# Altium schematic sheet Regulation_Charging.SchDoc
size A3; Organization: Altium Limited; Address1: L3, 12a Rodborough Rd; Address2: Frenchs Forest; Address3: NSW; Address4: Australia 2086; SheetNumber: 7; SheetTotal: 8
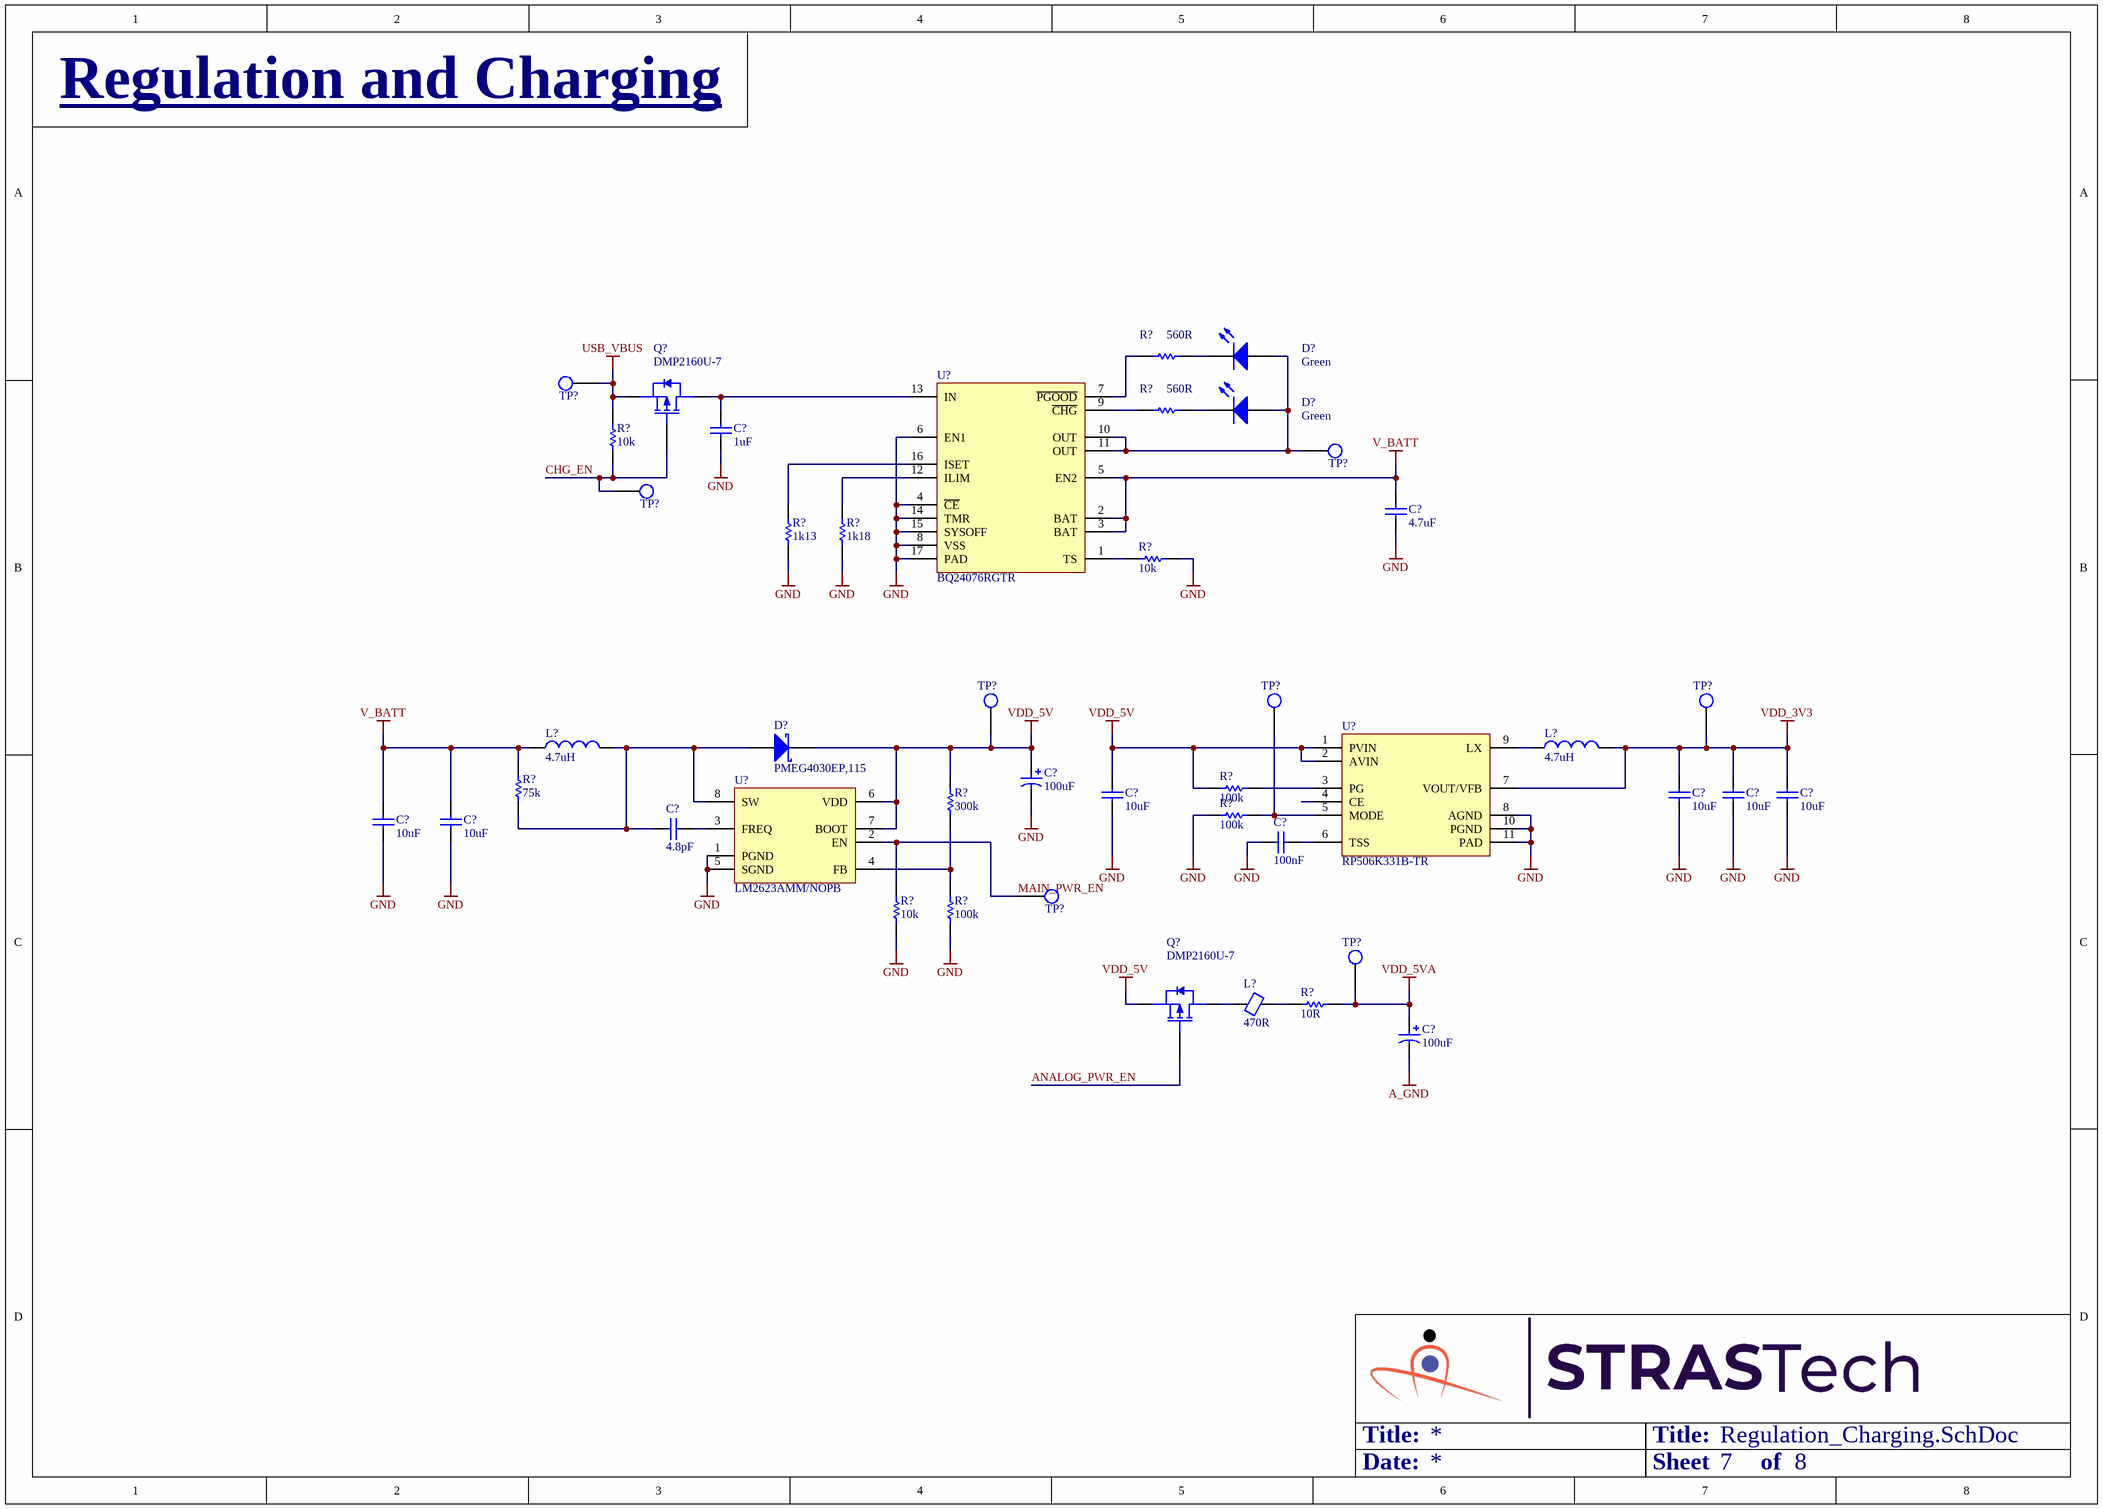
[diagram p0: Regulation_Charging.SchDoc]

## Parts
(Parts that share a designator on the sheet are numbered #1, #2 ... from top to bottom, then left to right.)
C?#1  1uF  [Cap,SMD,0402]
C?#2  4.7uF  [Cap,SMD,0402]
C?#3  100uF  [Cap,Alum,SMD,D5,H5.8]
C?#4  10uF  [Cap,SMD,0402]
C?#5  10uF  [Cap,SMD,0402]
C?#6  10uF  [Cap,SMD,0402]
C?#7  10uF  [Cap,SMD,0402]
C?#8  10uF  [Cap,SMD,0402]
C?#9  10uF  [Cap,SMD,0402]
C?#10  4.8pF  [Cap,SMD,0402]
C?#11  100nF  [Cap,SMD,0402]
C?#12  100uF  [Cap,Alum,SMD,D5,H5.8]
D?#1  Green  [LED,0603]
D?#2  Green  [LED,0603]
D?#3  PMEG4030EP,115  [SOD128]
L?#1  4.7uH  [IND,WIREWOUND,4.9x4.9,SMD]
L?#2  4.7uH  [IND,WIREWOUND,4.9x4.9,SMD]
L?#3  470R  [IND,0402]
Q?#1  DMP2160U-7  [SOT23-3]
Q?#2  DMP2160U-7  [SOT23-3]
R?#1  560R  [RES,0402]
R?#2  560R  [RES,0402]
R?#3  10k  [RES,0402]
R?#4  1k13  [RES,0402]
R?#5  1k18  [RES,0402]
R?#6  10k  [RES,0402]
R?#7  75k  [RES,0402]
R?#8  100k  [RES,0402]
R?#9  300k  [RES,0402]
R?#10  100k  [RES,0402]
R?#11  10k  [RES,0402]
R?#12  100k  [RES,0402]
R?#13  10R  [RES,0402]
TP?#1  TESTPOINT  [testpoint,smd,round,1mm]  (value not drawn)
TP?#2  TESTPOINT  [testpoint,smd,round,1mm]  (value not drawn)
TP?#3  TESTPOINT  [testpoint,smd,round,1mm]  (value not drawn)
TP?#4  TESTPOINT  [testpoint,smd,round,1mm]  (value not drawn)
TP?#5  TESTPOINT  [testpoint,smd,round,1mm]  (value not drawn)
TP?#6  TESTPOINT  [testpoint,smd,round,1mm]  (value not drawn)
TP?#7  TESTPOINT  [testpoint,smd,round,1mm]  (value not drawn)
TP?#8  TESTPOINT  [testpoint,smd,round,1mm]  (value not drawn)
U?#1  BQ24076RGTR  [IC,QFN-16,3x3]
U?#2  RP506K331B-TR  [IC,DFN-10_3x3,P0.5mm]
U?#3  LM2623AMM/NOPB  [IC,TSSOP-8,W3.0]

## Nets
A_GND: C?#12.2
GND: C?#1.1 C?#2.1 C?#3.2 C?#4.1 C?#5.1 C?#6.1 C?#7.1 C?#8.1 C?#9.1 C?#11.1 R?#4.1 R?#5.1 R?#6.1 R?#10.2 R?#11.1 R?#12.1 U?#1.4(~{CE}) U?#1.6(EN1) U?#1.8(VSS) U?#1.14(TMR) U?#1.15(SYSOFF) U?#1.17(PAD) U?#2.8(AGND) U?#2.10(PGND) U?#2.11(PAD) U?#3.1(PGND) U?#3.5(SGND)
USB_VBUS: Q?#1.2(S) R?#3.2 TP?#1.1(TP)
V_BATT: C?#2.2 C?#8.2 C?#9.2 L?#1.1 R?#7.2 U?#1.2(BAT) U?#1.3(BAT) U?#1.5(EN2)
VDD_3V3: C?#5.2 C?#6.2 C?#7.2 L?#2.2 TP?#6.1(TP) U?#2.7(VOUT/VFB)
VDD_5V: C?#3.1 C?#4.2 D?#3.1(K) Q?#2.2(S) R?#8.2 R?#9.2 TP?#4.1(TP) U?#2.1(PVIN) U?#2.2(AVIN) U?#3.6(VDD) U?#3.7(BOOT)
VDD_5VA: C?#12.1 R?#13.2 TP?#8.1(TP)
ANALOG_PWR_EN: Q?#2.1(G)
CHG_EN: Q?#1.1(G) R?#3.1 TP?#3.1(TP)
MAIN_PWR_EN: R?#11.2 TP?#7.1(TP) U?#3.2(EN)
NetC?#1_2: C?#1.2 Q?#1.3(D) U?#1.13(IN)
NetC?#10_1: C?#10.1 D?#3.2(A) L?#1.2 R?#7.1 U?#3.8(SW)
NetC?#10_2: C?#10.2 U?#3.3(FREQ)
NetC?#11_2: C?#11.2 U?#2.6(TSS)
NetD?#1_1: D?#1.1(A) D?#2.1(A) TP?#2.1(TP) U?#1.10(OUT) U?#1.11(OUT)
NetD?#1_2: D?#1.2(K) R?#1.2
NetD?#2_2: D?#2.2(K) R?#2.2
NetL?#2_1: L?#2.1 U?#2.9(LX)
NetL?#3_1: L?#3.1 Q?#2.3(D)
NetL?#3_2: L?#3.2 R?#13.1
NetR?#1_1: R?#1.1 U?#1.7(~{PGOOD})
NetR?#2_1: R?#2.1 U?#1.9(~{CHG})
NetR?#4_2: R?#4.2 U?#1.16(ISET)
NetR?#5_2: R?#5.2 U?#1.12(ILIM)
NetR?#6_2: R?#6.2 U?#1.1(TS)
NetR?#8_1: R?#8.1 U?#2.3(PG)
NetR?#9_1: R?#9.1 R?#12.2 U?#3.4(FB)
NetR?#10_1: R?#10.1 TP?#5.1(TP) U?#2.5(MODE)

Not connected (* = marked no-connect by the designer): U?#2 4(CE)

## Notes on the sheet
- Regulation and Charging
- Title:
- Date:
- Sheet
- of
- Title
- Size:
- A3
- Revision:
- Design By:

## Library data of the parts
C?#1 = CAP,Cer,1uF,35VDC,X5R,0402: 1 µF ±10% 35V Ceramic Capacitor X5R 0402 (1005 Metric); Vendor Part Number: 445-9073-1-ND; Manufacturer: TDK Corporation; Manufacturer Part Number: C1005X5R1V105K050BC; Vendor: Digikey; HelpURL: https://product.tdk.com/info/en/catalog/datasheets/mlcc_commercial_general_en.pdf?ref_disty=digikey; CreatedBy: Judd Foster
C?#2 = CAP,Cer,4.7uF,16VDC,X5R,0402: 4.7 µF ±20% 16V Ceramic Capacitor X5R 0402 (1005 Metric); Vendor Part Number: 478-10788-1-ND; Manufacturer: AVX Corporation; Manufacturer Part Number: 0402YD475MAT2A; Vendor: Digikey; HelpURL: https://datasheets.avx.com/cx5r.pdf; CreatedBy: Judd Foster
C?#3 C?#12 = CAP,Alum,100uF,10VDC,SMD: CAP ALUM 100UF 20% 10V SMD; Vendor Part Number: PCE3867CT-ND; Manufacturer: Panasonic; Manufacturer Part Number: EEE-1AA101WR; Vendor: Digikey; HelpURL: https://media.digikey.com/pdf/Data%20Sheets/Panasonic%20Electronic%20Components/S_Series,Type_V_Rev2018.pdf; CreatedBy: Judd Foster
C?#4-C?#9 = CAP,Cer,10uF,10VDC,X5R,0402: 10 µF ±20% 10V Ceramic Capacitor X5R 0402 (1005 Metric); Vendor Part Number: 1276-1450-1-ND; Manufacturer: Samsung Electro-Mechanics; Manufacturer Part Number: CL05A106MP5NUNC; Vendor: Digikey; HelpURL: https://media.digikey.com/pdf/Data%20Sheets/Samsung%20PDFs/CL05A106MP5NUNC_Spec.pdf; CreatedBy: Judd Foster
C?#10 = CAP,Cer,4.8pF,50VDC,C0G/NP0,0402: 4.8 pF ±0.25pF 50V Ceramic Capacitor C0G, NP0 0402 (1005 Metric); Vendor Part Number: 490-17481-1-ND; Manufacturer: Murata Electronics; Manufacturer Part Number: GCQ1555C1H4R8CB01D; Vendor: Digikey; HelpURL: https://search.murata.co.jp/Ceramy/image/img/A01X/G101/ENG/GCQ1555C1H4R8CB01-01.pdf; CreatedBy: Judd Foster
C?#11 = CAP,Cer,100nF,25VDC,X7R,0402: 0.1µF ±10% 25V Ceramic Capacitor X7R 0402 (1005 Metric); Vendor Part Number: 490-14603-1-ND; Manufacturer: Murata Electronics; Manufacturer Part Number: GRM155R71E104KE14J; Vendor: Digikey; HelpURL: https://search.murata.co.jp/Ceramy/image/img/A01X/G101/ENG/GRM155R71E104KE14-01.pdf; CreatedBy: Judd Foster
D?#1 D?#2 = LED,Green,SMD,0603: Green 530nm LED Indication - Discrete 3V 0603 (1608 Metric); Manufacturer: Stanley Electric Co; Manufacturer Part Number: THG1111C-0005-TR; Vendor Part Number: 404-1286-1-ND; Vendor: Digikey; CreatedBy: Judd Foster; HelpURL: http://www.stanley-components.com/php/downloaddatafile.php?rp=0,THG1111C-0005_e.pdf
D?#3 = DIODE,Schottky,40V,3A,SMD: Diode Schottky 40V 3A Surface Mount CFP5; Manufacturer: Nexperia USA Inc.; Vendor Part Number: 1727-5841-1-ND; Vendor: Digikey; CreatedBy: Judd Foster; HelpURL: https://assets.nexperia.com/documents/data-sheet/PMEG4030EP.pdf; Manufacturer Part Number: PMEG4030EP,115
L?#1 L?#2 = IND,4.7uH,2.6A,Wirewound,SMD: 4.7µH Shielded Wirewound Inductor 2.6A 45.5mOhm Max Nonstandard; Vendor Part Number: 587-3605-1-ND; Manufacturer: Taiyo Yuden; Manufacturer Part Number: NRS5030T4R7MMGJV; Vendor: Digikey; HelpURL: https://ds.yuden.co.jp/TYCOMPAS/ut/detail?pn=NRS5030T4R7MMGJV%20%20&u=M; CreatedBy: Judd Foster
L?#3 = Ferrite,470R@100MHz,0402: 470 Ohms @ 100 MHz 1 Power Line Ferrite Bead 0402 (1005 Metric) 1A 200mOhm; Vendor Part Number: 490-10662-1-ND; Manufacturer: Murata Electronics; Manufacturer Part Number: BLM15PX471SN1D; Vendor: Digikey; HelpURL: https://www.murata.com/en-us/products/productdata/8796740059166/ENFA0018.pdf; CreatedBy: Judd Foster
Q?#1 Q?#2 = MOSFET,P Ch,20V,3.2A: P-Channel 20 V 3.2A (Ta) 1.4W (Ta) Surface Mount SOT-23-3; Manufacturer: Diodes Incorporated; Vendor Part Number: DMP2160UDICT-ND; Vendor: Digikey; CreatedBy: Judd Foster; HelpURL: https://media.digikey.com/pdf/Data%20Sheets/Diodes%20PDFs/DMP2160U.pdf; Manufacturer Part Number: DMP2160U-7
R?#1 R?#2 = RES,560R,1%,0.063W,0402: 560 Ohms ±1% 0.063W, 1/16W Chip Resistor 0402 (1005 Metric) Automotive AEC-Q200, Moisture Resistant Thick Film; Manufacturer: TE Connectivity Passive Product; Manufacturer Part Number: CRGCQ0402F560R; Vendor Part Number: A129624CT-ND; Vendor: Digikey; CreatedBy: Judd Foster; HelpURL: https://www.te.com/commerce/DocumentDelivery/DDEController?Action=srchrtrv&DocNm=1773204-3&DocType=DS&DocLang=English
R?#3 R?#6 R?#11 = RES,10k,5%,0.063W,0402: 10 kOhms ±5% 0.063W, 1/16W Chip Resistor 0402 (1005 Metric) Automotive AEC-Q200 Thick Film; Vendor Part Number: RMCF0402JT10K0CT-ND; Manufacturer: Stackpole Electronics Inc; Manufacturer Part Number: RMCF0402JT10K0; Vendor: DIgikey; HelpURL: https://www.seielect.com/catalog/sei-rmcf_rmcp.pdf; CreatedBy: Judd Foster
R?#4 = RES,1k13,1%,0.063W,0402: 1.13 kOhms ±1% 0.063W, 1/16W Chip Resistor 0402 (1005 Metric) Automotive AEC-Q200 Thick Film; Manufacturer: Stackpole Electronics Inc; Manufacturer Part Number: RMCF0402FT1K13; Vendor Part Number: RMCF0402FT1K13CT-ND; Vendor: Digikey; CreatedBy: Judd Foster; HelpURL: https://www.seielect.com/catalog/sei-rmcf_rmcp.pdf
R?#5 = RES,1k18,1%,0.063W,0402: 1.18 kOhms ±1% 0.063W, 1/16W Chip Resistor 0402 (1005 Metric) Automotive AEC-Q200 Thick Film; Manufacturer: Stackpole Electronics Inc; Manufacturer Part Number: RMCF0402FT1K18; Vendor Part Number: RMCF0402FT1K18CT-ND; Vendor: Digikey; CreatedBy: Judd Foster; HelpURL: https://www.seielect.com/catalog/sei-rmcf_rmcp.pdf
R?#7 = RES,75k,0.1%,0.063W,0402: 75 kOhms ±0.1% 0.063W, 1/16W Chip Resistor 0402 (1005 Metric) - Thin Film; Vendor Part Number: YAG4414CT-ND; Manufacturer: YAGEO; Manufacturer Part Number: RT0402BRE0775KL; Vendor: DIgikey; HelpURL: https://www.yageo.com/upload/media/product/productsearch/datasheet/rchip/PYu-RT_1-to-0.01_RoHS_L_12.pdf; CreatedBy: Judd Foster
R?#8 R?#10 R?#12 = RES,100k,5%,0.1W,0402: 100 kOhms ±5% 0.1W, 1/10W Chip Resistor 0402 (1005 Metric) Automotive AEC-Q200 Thick Film; Manufacturer: Panasonic Electronic Components; Manufacturer Part Number: ERJ-2GEJ104X; Vendor Part Number: P100KJCT-ND; Vendor: Digikey; CreatedBy: Judd Foster; HelpURL: https://b2b-api.panasonic.eu/file_stream/pids/fileversion/1242
R?#9 = RES,300k,1%,0.063W,0402: 300 kOhms ±1% 0.063W, 1/16W Chip Resistor 0402 (1005 Metric) Automotive AEC-Q200 Thick Film; Manufacturer: Stackpole Electronics Inc; Manufacturer Part Number: RMCF0402FT300K; Vendor Part Number: RMCF0402FT300KCT-ND; Vendor: Digikey; CreatedBy: Judd Foster; HelpURL: https://www.seielect.com/catalog/sei-rmcf_rmcp.pdf
R?#13 = RES,10R,1%,0.063W,0402: 10 Ohms ±1% 0.063W, 1/16W Chip Resistor 0402 (1005 Metric) Automotive AEC-Q200 Thick Film; Manufacturer: Panasonic Electronic Components; Manufacturer Part Number: ERJ-2RKF10R0X; Vendor Part Number: P10.0LCT-ND; Vendor: Digikey; CreatedBy: Judd Foster; HelpURL: https://industrial.panasonic.com/cdbs/www-data/pdf/RDA0000/AOA0000C304.pdf
TP?#1-TP?#8 = TESTPOINT: PCB Testpoint; CreatedBy: Judd Foster; HelpURL: N/A; Manufacturer: N/A; Manufacturer Part Number: N/A; Vendor: N/A; Vendor Part Number: N/A
U?#1 = BQ24076RGTR: Charger IC Lithium Ion 16-VQFN (3x3); Vendor Part Number: 296-52627-1-ND; Manufacturer: Texas Instruments; Vendor: Digikey; HelpURL: https://www.ti.com/general/docs/suppproductinfo.tsp?distId=10&gotoUrl=https%3A%2F%2Fwww.ti.com%2Flit%2Fgpn%2Fbq24076; Manufacturer Part Number: BQ24076RGTR; CreatedBy: Judd Foster
U?#2 = RP506K331B-TR: Buck Switching Regulator IC Positive Fixed 3.3V 1 Output 2A 10-UFDFN Exposed Pad; Manufacturer: Nisshinbo Micro Devices Inc.; Vendor Part Number: 2129-RP506K331B-CT-ND; Vendor: Digikey; CreatedBy: Judd Foster; HelpURL: https://www.nisshinbo-microdevices.co.jp/en/pdf/datasheet/rp506-ea.pdf; Manufacturer Part Number: RP506K331B-TR
U?#3 = LM2623AMM/NOPB: Boost Switching Regulator IC Positive Adjustable 1.24V 1 Output 2.2A (Switch) 8-TSSOP, 8-MSOP (0.118", 3.00mm Width); Vendor Part Number: LM2623AMM/NOPBCT-ND; Manufacturer: Texas Instruments; Vendor: Digikey; Manufacturer Part Number: LM2623AMM/NOPB; HelpURL: https://www.ti.com/general/docs/suppproductinfo.tsp?distId=10&gotoUrl=https%3A%2F%2Fwww.ti.com%2Flit%2Fgpn%2Flm2623; CreatedBy: Judd Foster